# EAGLE design Exp_Board_Slolu_v0.2.1 (EAGLE 6.5.0)
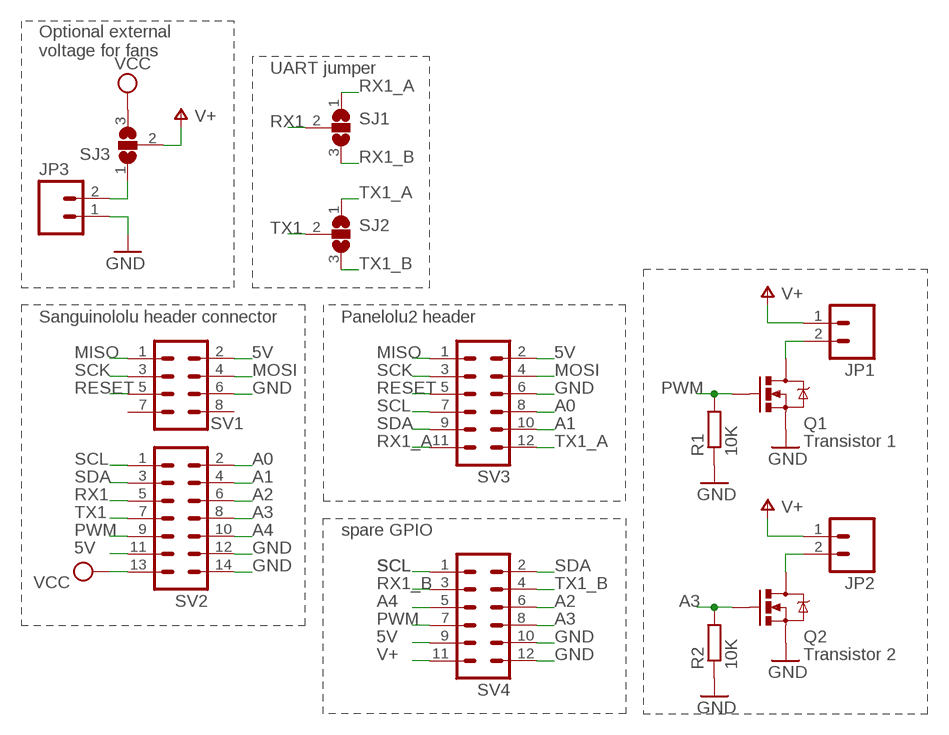
[diagram p0: schematic, sheet 1]

## Parts
JP1  M02PTH  [1X02]
JP2  M02PTH  [1X02]
JP3  M02LOCK  [1X02_LOCK]
Q1  Transistor 1  MOSFET-NCHANNELPTH2  [TO220V]
Q2  Transistor 2  MOSFET-NCHANNELPTH2  [TO220V]
R1  10K  R-EU_0204/7  [0204/7]
R2  10K  R-EU_0204/7  [0204/7]
SJ1  SJ2W  [SJ_2]
SJ2  SJ2W  [SJ_2]
SJ3  SJ2W  [SJ_2]
SV1  MA04-2  [MA04-2]
SV2  MA07-2  [MA07-2]
SV3  MA06-2  [MA06-2]
SV4  MA06-2  [MA06-2]

## Nets
5V: SV1.2 SV2.11 SV3.2 SV4.9
A0: SV2.2 SV3.8
A1: SV2.4 SV3.10
A2: SV2.6 SV4.6
A3: Q2.1(G) R2.2 SV2.8 SV4.8
A4: SV2.10 SV4.5
EXT-V+: JP3.2 SJ3.1
GND: JP3.1 Q1.3(S) Q2.3(S) R1.1 R2.1 SV1.6 SV2.12 SV2.14 SV3.6 SV4.10 SV4.12
MISO: SV1.1 SV3.1
MOSI: SV1.4 SV3.4
N$1: JP1.2 Q1.2(D)
N$2: JP2.2 Q2.2(D)
PWM: Q1.1(G) R1.2 SV2.9 SV4.7
RESET: SV1.5 SV3.5
RX1: SJ1.2 SV2.5
RX1_A: SJ1.1 SV3.11
RX1_B: SJ1.3 SV4.3
SCK: SV1.3 SV3.3
SCL: SV2.1 SV3.7 SV4.1
SDA: SV2.3 SV3.9 SV4.2
TX1: SJ2.2 SV2.7
TX1_A: SJ2.1 SV3.12
TX1_B: SJ2.3 SV4.4
V+: JP1.1 JP2.1 SJ3.2 SV4.11
VCC: SJ3.3 SV2.13
Unconnected: SV1.7 SV1.8

## Notes on the sheet
- Optional external 
  voltage for fans
- UART jumper
- Sanguinololu header connector | Panelolu2 header
- spare GPIO

## Library data of the parts
JP1-JP3 = SparkFun-Connectors:M02: Header 2 Standard 2-pin 0.1" header. Use with straight break away headers (SKU : PRT-00116), right angle break away headers (PRT-00553), swiss pins (PRT-00743), machine pins (PRT-00117), and female headers (PRT-00115). Molex polarized connector foot print use with SKU : PRT-08233 with associated crimp pins and housings.
Q1 Q2 = SparkFun-DiscreteSemi:MOSFET-NCHANNEL: Generic NMOS footprint
R1 R2 = resistor:R-EU_: RESISTOR, European symbol
SJ1-SJ3 = jumper:SJ2W: SMD solder JUMPER
SV1 = con-lstb:MA04-2: PIN HEADER; OC_FARNELL: unknown; OC_NEWARK: unknown
SV2 = con-lstb:MA07-2: PIN HEADER; OC_FARNELL: unknown; OC_NEWARK: unknown
SV3 SV4 = con-lstb:MA06-2: PIN HEADER; OC_FARNELL: unknown; OC_NEWARK: unknown

## Board
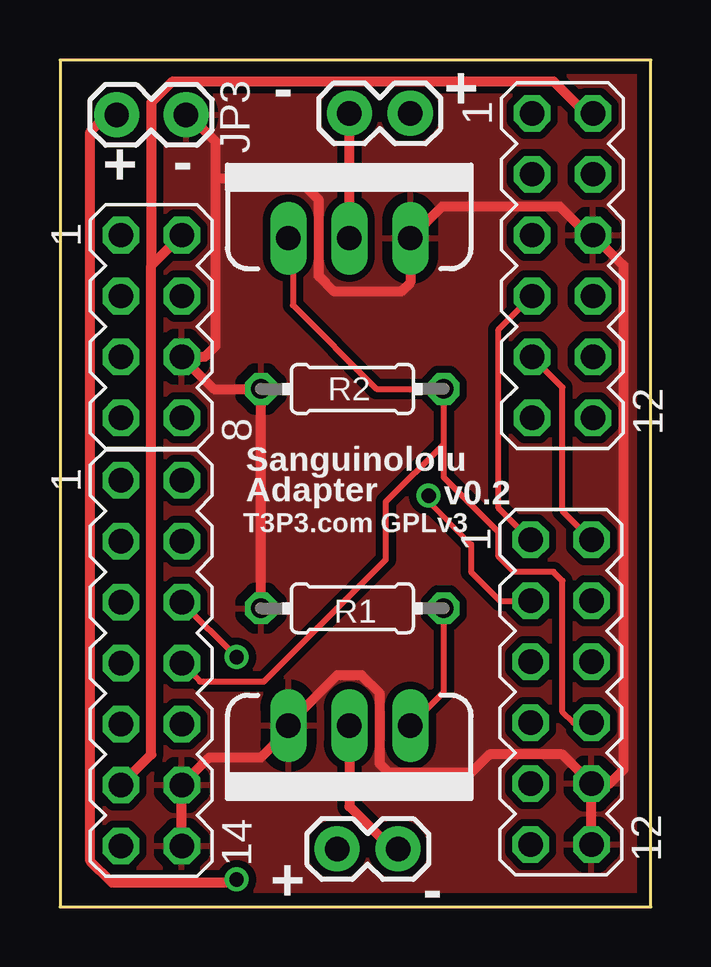
[diagram p1: board, top side]
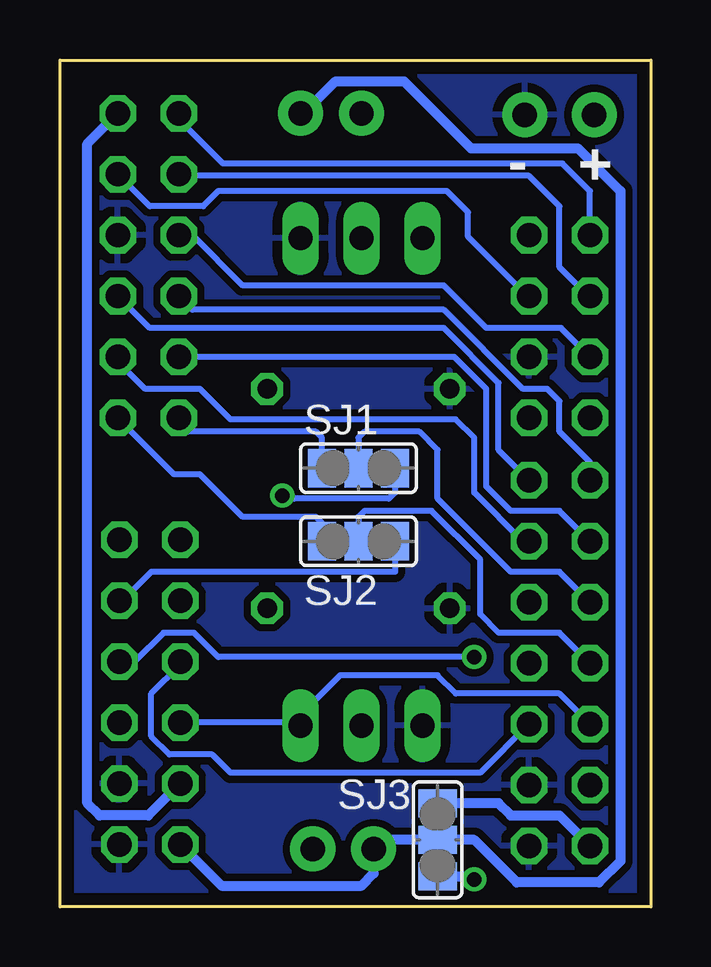
[diagram p2: board, bottom side, seen from below]

Size 24.64 x 35.31 mm. Coordinates in mm from the lower left corner, seen from the top.
Outline: 0,0 24.64,0 24.64,35.31 0,35.31 0,0
Copper layers (1*16): Top 0.035mm / dielectric 1.5mm / Bottom 0.035mm
Design rules "OSH park": minimum track width 6mil, minimum drill 13mil, track to track 6mil, track to pad 6mil, pad to pad 6mil, via to via 6mil, smd to smd 6mil, copper to edge 20mil, drill to drill 16mil, minimum pad ring 10mil, minimum via ring 8mil, stop-mask expansion 4mil, vias tented up to drill 0mil, thermal gap 16mil

### Footprints (pad centres in the part's own frame; a part is rotated, then mirrored left to right if it is on the bottom)
1X02 = drill 1.016 pad 1.88: 1 0,0; 2 2.54,0
1X02_LOCK = drill 1.016 pad 1.88: 1 -0.178,0; 2 2.718,0
TO220V = drill 1.016 long: 1 -2.54,0; 2 0,0; 3 2.54,0
0204/7 = drill 0.813 octagon: 1 -3.81,0; 2 3.81,0
SJ_2 = smd 1.168 x 1.6: 1 -1.524,0; 2 0,0; 3 1.524,0
MA04-2 = drill 1.016 octagon: 1 -3.81,-1.27; 2 -3.81,1.27; 3 -1.27,-1.27; 4 -1.27,1.27; 5 1.27,-1.27; 6 1.27,1.27; 7 3.81,-1.27; 8 3.81,1.27
MA07-2 = drill 1.016 octagon: 1 -7.62,-1.27; 2 -7.62,1.27; 3 -5.08,-1.27; 4 -5.08,1.27; 5 -2.54,-1.27; 6 -2.54,1.27; 7 0,-1.27; 8 0,1.27; 9 2.54,-1.27; 10 2.54,1.27; 11 5.08,-1.27; 12 5.08,1.27; 13 7.62,-1.27; 14 7.62,1.27
MA06-2 = drill 1.016 octagon: 1 -6.35,-1.27; 2 -6.35,1.27; 3 -3.81,-1.27; 4 -3.81,1.27; 5 -1.27,-1.27; 6 -1.27,1.27; 7 1.27,-1.27; 8 1.27,1.27; 9 3.81,-1.27; 10 3.81,1.27; 11 6.35,-1.27; 12 6.35,1.27

### Placement (x,y rotation side)
JP1  11.56,2.41 0 top
JP2  14.61,33.08 180 top
JP3  5.08,33.02 180 top
Q1  12.06,7.56 180 top
Q2  12.06,27.88 0 top
R1  12.19,12.45 0 top
R2  12.19,21.59 0 top
SJ1  12.19,18.29 0 bottom
SJ2  12.19,15.24 0 bottom
SJ3  8.89,2.79 90 bottom
SV1  3.81,24.19 270 top
SV2  3.81,10.16 270 top
SV3  20.95,26.73 270 top
SV4  20.89,8.95 270 top

### Tracks (layer width: path | path; a pad name or v marks a point on that pad's centre or on a via)
5V
  Top 0.406: 22.16,33.08 SV3.2 21.91,33.08 20.57,34.42 4.7,34.42 3.81,33.53 3.81,26.73 | 5.14,28.07 SV1.2 3.81,26.73 | SV2.11 3.81,6.35 3.81,26.73
  Bottom 0.406: SV4.9 20.95,3.81 22.99,3.81 23.5,4.32 23.5,31.81 SV3.2
A0
  Bottom 0.254: SV3.8 20.89,24.13 8.64,24.13 6.35,21.84 6.35,19.05 SV2.2
A1
  Bottom 0.254: SV3.10 22.23,22.73 21.08,21.59 18.8,21.59 17.53,20.32 8.13,20.32 7.37,19.56 7.37,17.27 5.33,15.24 SV2.4
A2  (via drill 0.6)
  Top 0.254: SV2.6 v7.37,10.41
  Bottom 0.254: SV4.6 21.53,10.22 20.32,11.43 19.05,11.43 18.03,10.41 v7.37,10.41
A3
  Top 0.254: Q2.1 9.72,27.88 9.72,25.08 13.21,21.59 R2.2 16,19.3 | SV4.8 21.4,7.68 20.95,8.13 20.95,13.59 20.57,13.97 18.92,13.97 18.29,14.61 18.29,15.62 16,17.91 16,19.3 | SV2.8 5.84,9.4 8.51,9.4 13.59,14.48 13.59,16.89 16,19.3
A4
  Bottom 0.254: SV2.10 7.11,5.59 17.53,5.59 18.29,6.35 20.07,6.35 20.83,7.11 20.83,8.89 19.62,10.1 SV4.5
EXT-V+  (via drill 0.6)
  Top 0.406: v7.37,1.14 7.24,1.02 2.16,1.02 1.27,1.91 1.27,32.31 1.98,33.02 JP3.2
  Bottom 0.406: SJ3.1 7.49,1.27 v7.37,1.14
GND
  Top 0.406: SV2.14 SV2.12 6.22,6.22 8.38,6.22 9.53,7.37 Q1.3 9.53,7.62 11.56,9.65 12.57,9.65 13.34,8.89 13.34,5.97 13.72,5.59 17.14,5.59 17.91,6.35 20.95,6.35 SV4.10 | R1.1 R2.1 6.41,21.59 SV1.6 6.03,22.92 6.48,23.37 6.48,30.35 | SV4.12 SV4.10 | 6.48,30.35 6.48,31.93 5.38,33.02 JP3.1 | 6.48,30.35 9.91,30.35 10.79,29.46 10.79,26.29 11.43,25.65 14.22,25.65 14.61,26.04 Q2.3 15.94,29.21 20.83,29.21 22.04,28 SV3.6 23.5,26.73 23.5,5.71 22.92,5.14 SV4.10
  pour Bottom (isolate 0.305): 0,35.31 24.64,35.31 24.64,0 0,0
  pour Top (isolate 0.305): 0,35.31 24.64,35.31 24.64,0 0,0
MISO
  Bottom 0.254: SV1.1 2.54,29.84 3.68,30.99 17.84,30.99 19.68,32.83 SV3.1
MOSI
  Bottom 0.254: SV1.4 5.14,25.46 7.62,27.94 7.62,28.96 8.51,29.84 18.03,29.84 18.67,29.21 20.89,29.21 SV3.4
N$1
  Top 0.406: Q1.2 12.06,4.19 13.84,2.41 JP1.2
N$2
  Top 0.406: Q2.2 JP2.2
PWM
  Top 0.254: Q1.1 16,8.95 R1.2
  Bottom 0.254: SV2.9 3.81,8.89 8.13,8.89 8.89,9.65 12.95,9.65 14.61,8 Q1.1 14.73,7.68 SV4.7
RESET
  Bottom 0.254: SV1.5 3.75,24.13 6.86,24.13 8.64,25.91 17.02,25.91 19.11,28 SV3.5
RX1
  Bottom 0.254: SV2.5 3.81,13.97 5.84,13.97 8.89,17.02 8.89,19.05 9.65,19.81 11.94,19.81 12.19,19.56 SJ1.2
RX1_A
  Bottom 0.254: SJ1.1 13.72,19.56 13.97,19.81 19.3,19.81 19.68,20.19 SV3.11
RX1_B  (via drill 0.6)
  Top 0.203: 17.14,15.11 15.37,16.89 v15.37,17.14
  Top 0.254: 17.14,15.11 17.14,13.97 18.35,12.76 SV4.3
  Bottom 0.254: SJ1.3 10.67,17.27 10.92,17.02 14.86,17.02 14.99,17.14 v15.37,17.14
SCK
  Bottom 0.254: SV1.3 2.6,25.46 3.81,26.67 3.81,29.21 5.08,30.48 19.49,30.48
  Bottom 0.406: 19.49,30.48 19.62,30.48 SV3.3
SCL
  Top 0.254: SV4.1 18.29,16.64 18.29,24.07 SV3.7
  Bottom 0.254: SV3.7 19.11,24.89 8.64,24.89 5.33,21.59 4.32,21.59 3.81,21.08 3.81,19.81 2.54,18.54 SV2.1
SDA
  Top 0.254: SV4.2 20.95,16.51 20.95,21.65 SV3.9
  Bottom 0.254: SV2.3 3.81,16.51 5.84,16.51 6.86,17.53 6.86,21.59 8.19,22.92 SV3.9
TX1
  Bottom 0.254: SV2.7 3.81,11.43 6.35,11.43 7.11,12.19 7.11,14.48 9.14,16.51 11.94,16.51 12.19,16.26 SJ2.2
TX1_A
  Bottom 0.254: SJ2.1 13.72,16 13.97,16.26 17.02,16.26 18.8,18.03 19.88,18.03 SV3.12
TX1_B
  Bottom 0.254: SJ2.3 10.67,13.97 20.83,13.97 22.04,12.76 SV4.4
V+
  Bottom 0.406: SV4.11 17.91,0.89 12.06,0.89 11.56,1.4 JP1.1 11.3,2.41 10.92,2.79 SJ3.2 7.37,2.79 5.59,1.02 2.16,1.02 1.27,1.91 1.27,29.84 3.05,31.62 7.49,31.62 10.29,34.42 13.14,34.42 14.48,33.08 JP2.1
VCC
  Bottom 0.406: SV2.13 3.81,3.81 5.84,3.81 6.35,4.32 SJ3.3

### Text on the board
tPlace: - | + | + | - | Sanguinololu | Adapter | v0.2 | T3P3.com GPLv3 | + | -
bPlace: + | -